# EAGLE schematic SensePlant (EAGLE 8.6.0)
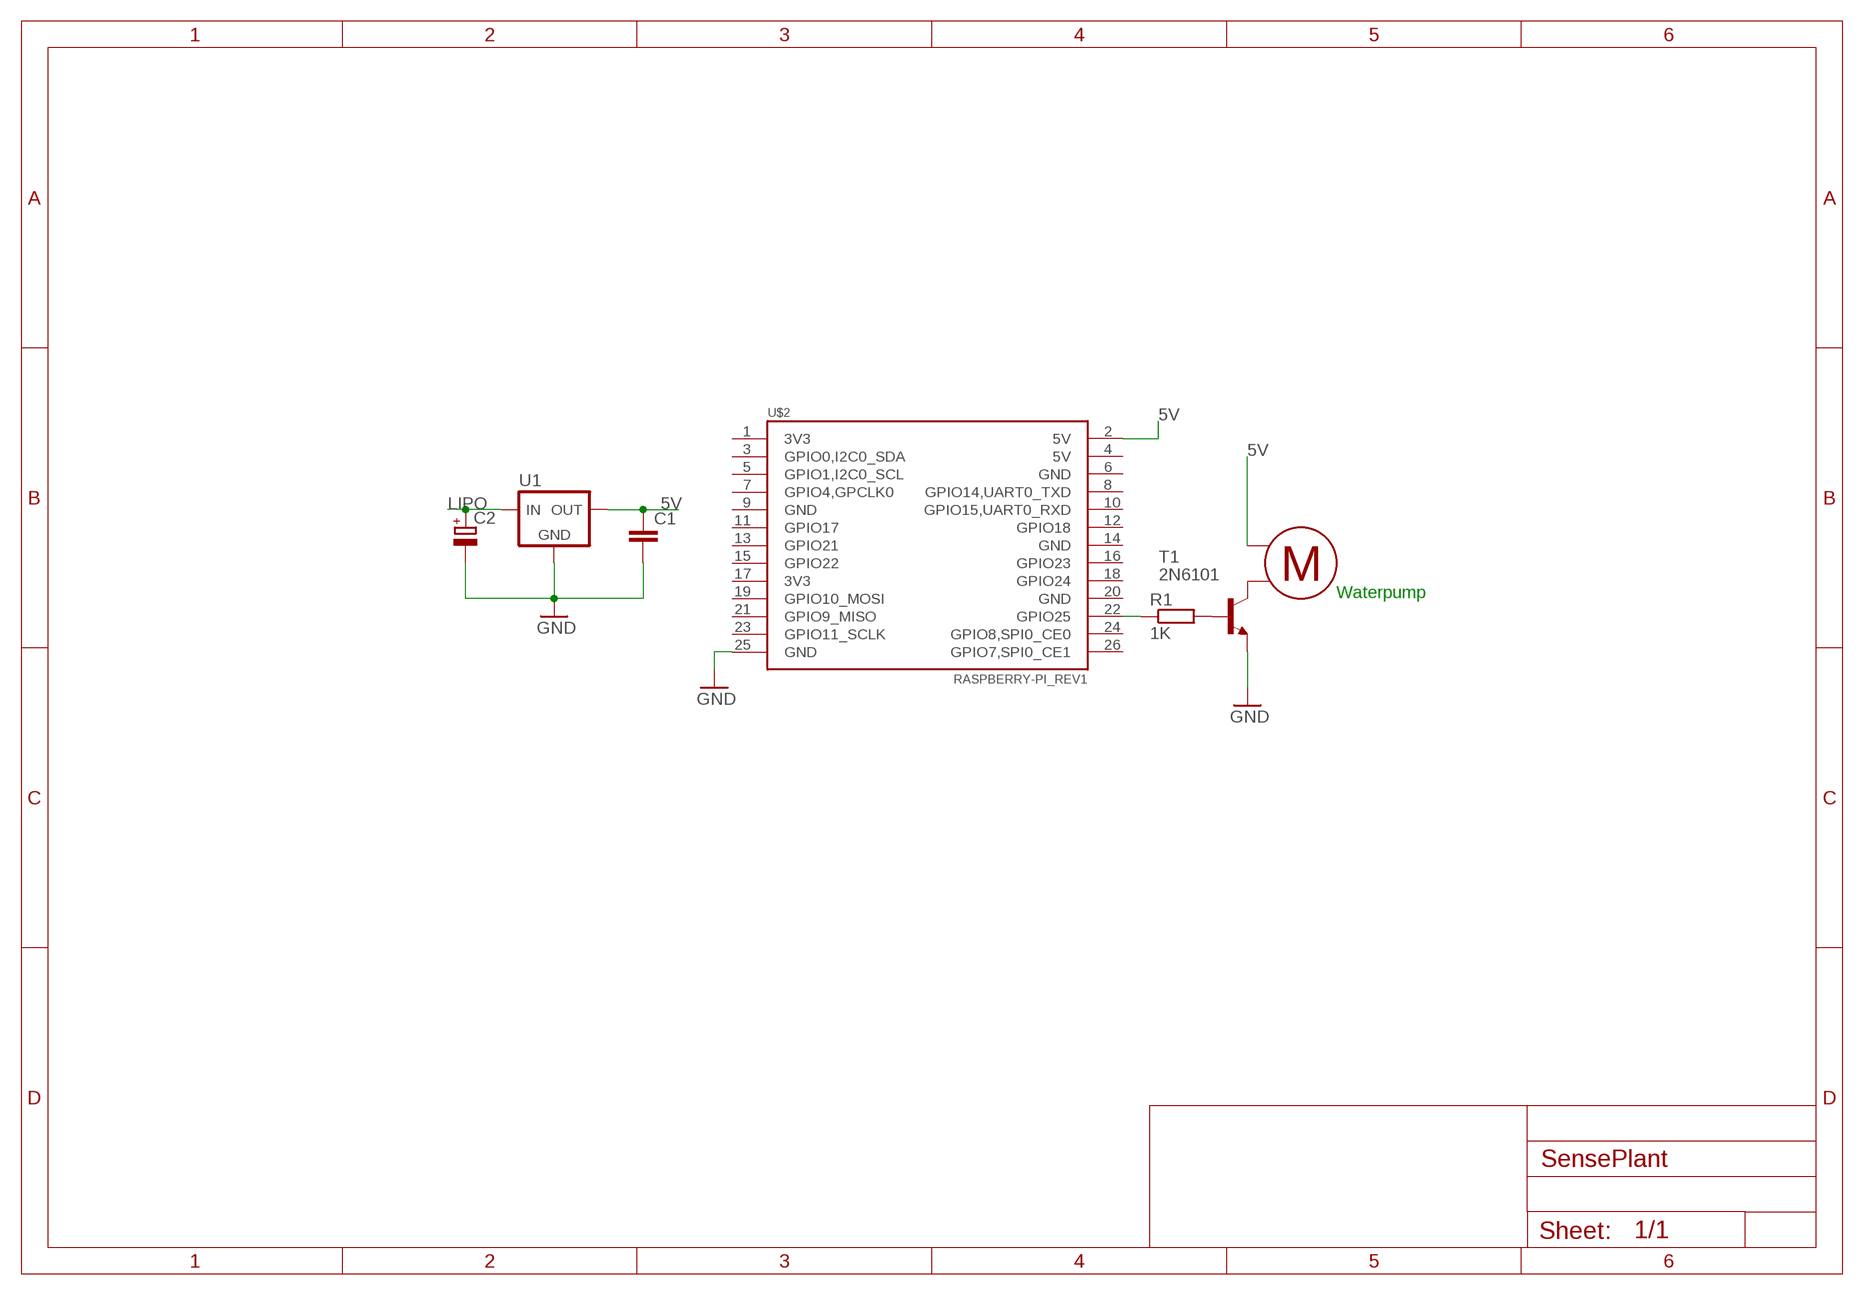
[diagram p0: schematic, sheet 1]

## Parts
C1  C-EU050-030X075  [C050-030X075]
C2  CPOL-EU153CLV-0505  [153CLV-0505]
R1  1K  R-EU_0207/7  [0207/7]
T1  2N6101  [TO220]
U1  78XX-TO220H  [TO220BH]
U$1  RASPBERRY-PI  [RASPBERRY-PI]  (not placed on a sheet)
U$2  RASPBERRY-PI_REV1  [RASPBERRY-PI_REV1]
U$3  MOTOR  [2]

## Nets
5V: C1.1 U1.3(VOUT) U$2.2(5V) U$3.P$1
GND: C1.2 C2.- T1.3(E) U1.2(GND) U$2.25(GND)
LIPO: C2.+ U1.1(VIN)
N$1: R1.2 T1.1(B)
N$2: R1.1 U$2.22(GPIO25)
N$3: T1.2(C) U$3.P$2
Unconnected: U$2.1(3V3) U$2.3(GPIO0,I2C0_SDA) U$2.4(5V) U$2.5(GPIO1,I2C0_SCL) U$2.6(GND) U$2.7(GPIO4,GPCLK0) U$2.8(GPIO14,UART0_TXD) U$2.9(GND) U$2.10(GPIO15,UART0_RXD) U$2.11(GPIO17) U$2.12(GPIO18) U$2.13(GPIO21) U$2.14(GND) U$2.15(GPIO22) U$2.16(GPIO23) U$2.17(3V3) U$2.18(GPIO24) U$2.19(GPIO10_MOSI) U$2.20(GND) U$2.21(GPIO9_MISO) U$2.23(GPIO11_SCLK) U$2.24(GPIO8,SPI0_CE0) U$2.26(GPIO7,SPI0_CE1)

## Notes on the sheet
- Waterpump

## Library data of the parts
C1 = rcl:C-EU: CAPACITOR, European symbol; SPICEPREFIX: C
C2 = rcl:CPOL-EU: POLARIZED CAPACITOR, European symbol; SPICEPREFIX: C
R1 = rcl:R-EU_: RESISTOR, European symbol; SPICEPREFIX: R
T1 = transistor:2N6101: NPN TRANSISTOR
U1 = bt_regulator:78XX: 78XX Linear Voltage Regulator The venerable 7800-series Linear Voltage Regulator, including 7805, 7809, 7812, 7815, 7862 in 5 V, 6.2 V, 8.2 V, 9 V, 12 V, and 15 V, respectively Datasheets TI_LM78L05.pdf <http://www.ti.com/lit/ds/symlink/lm78l05.pdf> Fairchild_LM7805.pdf <https://www.fairchildsemi.com/datasheets/LM/LM7805.pdf>
U$1 = RaspberryPi:RASPBERRY-PI: Raspberry Pi Board <http://www.raspberrypi.org/> Jacques Lagnel V1.0 (beta) 2012 Board dimension: Forum 3D model <http://www.raspberrypi.org/forum/general-discussion/mechanical-profile-3d-models?value=3d%20model&type=1&include=1&search=1&ret=all> The GPIO Connector (P1): http://elinux.org/RPi_Low-level_peripherals
U$2 = RaspberryPi:RASPBERRY-PI_REV1: Raspberry Pi Board <http://www.raspberrypi.org/> Jacques Lagnel V1.0 (beta) 2012 Mateusz Bawaj V1.1 (beta) 2012 Board dimension: Forum 3D model <http://www.raspberrypi.org/forum/general-discussion/mechanical-profile-3d-models?value=3d%20model&type=1&include=1&search=1&ret=all> The GPIO Connector (P1): http://elinux.org/RPi_Low-level_peripherals
U$3 = bt_automotive:MOTOR: generic motor